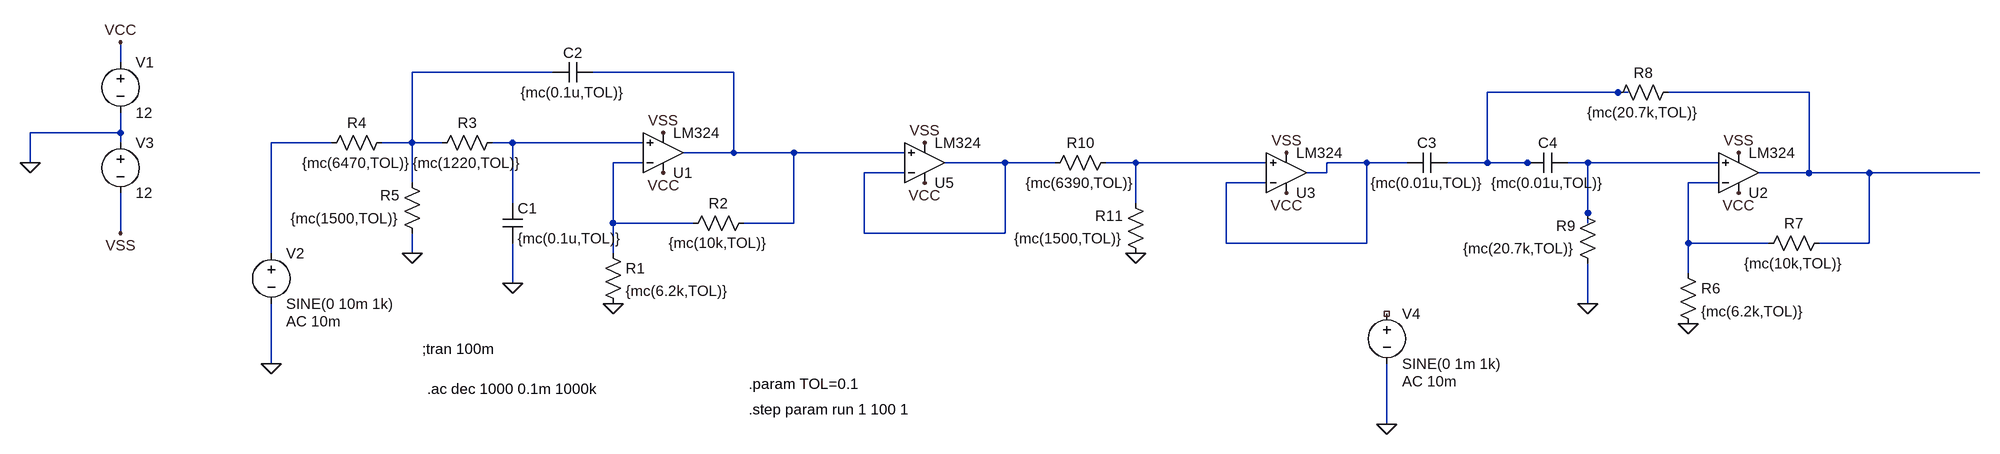
[diagram p0: schematic simulacion1_montecarloREAL.asc]
simulacion1_montecarloREAL.asc, the LTspice schematic file:
Version 4
SHEET 1 2244 700
WIRE -720 48 -720 16
WIRE -32 64 -256 64
WIRE 256 64 32 64
WIRE 1664 96 1456 96
WIRE 1680 96 1664 96
WIRE 1968 96 1744 96
WIRE -720 160 -720 128
WIRE -720 160 -864 160
WIRE -720 176 -720 160
WIRE -384 176 -480 176
WIRE -256 176 -256 64
WIRE -256 176 -304 176
WIRE -208 176 -256 176
WIRE -96 176 -128 176
WIRE 112 176 -96 176
WIRE 256 192 256 64
WIRE 256 192 176 192
WIRE 352 192 256 192
WIRE 528 192 352 192
WIRE -864 208 -864 160
WIRE 112 208 64 208
WIRE 688 208 592 208
WIRE 768 208 688 208
WIRE 896 208 848 208
WIRE 1104 208 896 208
WIRE 1264 208 1200 208
WIRE 1328 208 1264 208
WIRE 1456 208 1456 96
WIRE 1456 208 1392 208
WIRE 1520 208 1456 208
WIRE 1536 208 1520 208
WIRE 1616 208 1584 208
WIRE 1824 208 1616 208
WIRE 528 224 464 224
WIRE 1200 224 1200 208
WIRE 1200 224 1168 224
WIRE 1968 224 1968 96
WIRE 1968 224 1888 224
WIRE 2064 224 1968 224
WIRE 2240 224 2064 224
WIRE -256 240 -256 176
WIRE 1104 240 1040 240
WIRE 1824 240 1776 240
WIRE -96 272 -96 176
WIRE 896 272 896 208
WIRE 1616 288 1616 208
WIRE 64 304 64 208
WIRE 192 304 64 304
WIRE 352 304 352 192
WIRE 352 304 272 304
WIRE 1616 304 1616 288
WIRE -720 320 -720 256
WIRE 464 320 464 224
WIRE 688 320 688 208
WIRE 688 320 464 320
WIRE 1040 336 1040 240
WIRE 1264 336 1264 208
WIRE 1264 336 1040 336
WIRE 1776 336 1776 240
WIRE 1904 336 1776 336
WIRE 2064 336 2064 224
WIRE 2064 336 1984 336
WIRE -480 352 -480 176
WIRE -256 352 -256 320
WIRE 64 352 64 304
WIRE 1776 384 1776 336
WIRE -96 400 -96 336
WIRE 1616 432 1616 368
WIRE -480 528 -480 432
WIRE 1296 624 1296 528
FLAG 64 432 0
FLAG -480 528 0
FLAG -864 208 0
FLAG -720 16 VCC
FLAG 144 224 VCC
FLAG -720 320 VSS
FLAG 144 160 VSS
FLAG -96 400 0
FLAG -256 352 0
FLAG 1776 464 0
FLAG 1296 624 0
FLAG 1856 256 VCC
FLAG 1856 192 VSS
FLAG 1616 432 0
FLAG 1136 192 VSS
FLAG 1136 256 VCC
FLAG 896 352 0
FLAG 560 176 VSS
FLAG 560 240 VCC
SYMBOL AutoGenerated\\LM324 144 192 M180
SYMATTR InstName U1
SYMBOL voltage -720 32 R0
WINDOW 123 0 0 Left 0
WINDOW 39 0 0 Left 0
SYMATTR InstName V1
SYMATTR Value 12
SYMBOL res 48 336 R0
SYMATTR InstName R1
SYMATTR Value {mc(6.2k,TOL)}
SYMATTR SpiceLine tol=10
SYMBOL res 288 288 R90
WINDOW 0 0 56 VBottom 2
WINDOW 3 32 56 VTop 2
SYMATTR InstName R2
SYMATTR Value {mc(10k,TOL)}
SYMATTR SpiceLine tol=10
SYMBOL voltage -480 336 R0
WINDOW 123 24 124 Left 2
WINDOW 39 0 0 Left 0
SYMATTR Value2 AC 10m
SYMATTR InstName V2
SYMATTR Value SINE(0 10m 1k)
SYMBOL voltage -720 160 R0
WINDOW 123 0 0 Left 0
WINDOW 39 0 0 Left 0
SYMATTR InstName V3
SYMATTR Value 12
SYMBOL cap -112 272 R0
SYMATTR InstName C1
SYMATTR Value {mc(0.1u,TOL)}
SYMBOL res -112 160 R90
WINDOW 0 0 56 VBottom 2
WINDOW 3 32 56 VTop 2
SYMATTR InstName R3
SYMATTR Value {mc(1220,TOL)}
SYMATTR SpiceLine tol=10
SYMBOL res -288 160 R90
WINDOW 0 0 56 VBottom 2
WINDOW 3 32 56 VTop 2
SYMATTR InstName R4
SYMATTR Value {mc(6470,TOL)}
SYMATTR SpiceLine tol=10
SYMBOL cap 32 48 R90
WINDOW 0 0 32 VBottom 2
WINDOW 3 32 32 VTop 2
SYMATTR InstName C2
SYMATTR Value {mc(0.1u,TOL)}
SYMBOL res -240 336 R180
WINDOW 0 36 76 Left 2
WINDOW 3 36 40 Left 2
SYMATTR InstName R5
SYMATTR Value {mc(1500,TOL)}
SYMATTR SpiceLine tol=10
SYMBOL AutoGenerated\\LM324 1856 224 M180
SYMATTR InstName U2
SYMBOL res 1760 368 R0
SYMATTR InstName R6
SYMATTR Value {mc(6.2k,TOL)}
SYMATTR SpiceLine tol=10
SYMBOL res 2000 320 R90
WINDOW 0 0 56 VBottom 2
WINDOW 3 32 56 VTop 2
SYMATTR InstName R7
SYMATTR Value {mc(10k,TOL)}
SYMATTR SpiceLine tol=10
SYMBOL voltage 1296 432 R0
WINDOW 123 24 124 Left 2
WINDOW 39 0 0 Left 0
SYMATTR Value2 AC 10m
SYMATTR InstName V4
SYMATTR Value SINE(0 1m 1k)
SYMBOL res 1760 80 R90
WINDOW 0 0 56 VBottom 2
WINDOW 3 32 56 VTop 2
SYMATTR InstName R8
SYMATTR Value {mc(20.7k,TOL)}
SYMATTR SpiceLine tol=10
SYMBOL res 1632 384 R180
WINDOW 0 36 76 Left 2
WINDOW 3 36 40 Left 2
SYMATTR InstName R9
SYMATTR Value {mc(20.7k,TOL)}
SYMATTR SpiceLine tol=10
SYMBOL cap 1392 192 R90
WINDOW 0 0 32 VBottom 2
WINDOW 3 32 32 VTop 2
SYMATTR InstName C3
SYMATTR Value {mc(0.01u,TOL)}
SYMBOL cap 1584 192 R90
WINDOW 0 0 32 VBottom 2
WINDOW 3 32 32 VTop 2
SYMATTR InstName C4
SYMATTR Value {mc(0.01u,TOL)}
SYMBOL res 864 192 R90
WINDOW 0 0 56 VBottom 2
WINDOW 3 32 56 VTop 2
SYMATTR InstName R10
SYMATTR Value {mc(6390,TOL)}
SYMATTR SpiceLine tol=10
SYMBOL res 912 368 R180
WINDOW 0 36 76 Left 2
WINDOW 3 36 40 Left 2
SYMATTR InstName R11
SYMATTR Value {mc(1500,TOL)}
SYMATTR SpiceLine tol=10
SYMBOL AutoGenerated\\LM324 1136 224 M180
SYMATTR InstName U3
SYMBOL AutoGenerated\\LM324 560 208 M180
SYMATTR InstName U5
TEXT -240 504 Left 2 !;tran 100m
TEXT -232 568 Left 2 !.ac dec 1000 0.1m 1000k
TEXT 280 560 Left 2 !.param TOL=0.1
TEXT 280 600 Left 2 !.step param run 1 100 1

The netlist it stands for:
* simulacion1_montecarloREAL.asc
* U1: LM324 (symbol AutoGenerated\LM324 not available, pins judged from their places): In+=N006 In-=N007 V+=VCC V-=VSS OUT=N002
V1 VCC 0 12
R1 N007 0 {mc(6.2k,TOL)} tol=10
R2 N002 N007 {mc(10k,TOL)} tol=10
V2 N005 0 SINE(0 10m 1k) AC 10m
V3 0 VSS 12
C1 N006 0 {mc(0.1u,TOL)}
R3 N006 N001 {mc(1220,TOL)} tol=10
R4 N001 N005 {mc(6470,TOL)} tol=10
C2 N002 N001 {mc(0.1u,TOL)}
R5 0 N001 {mc(1500,TOL)} tol=10
* U2: LM324 (symbol AutoGenerated\LM324 not available, pins judged from their places): In+=N011 In-=N012 V+=VCC V-=VSS OUT=N004
R6 N012 0 {mc(6.2k,TOL)} tol=10
R7 N004 N012 {mc(10k,TOL)} tol=10
V4 NC_01 0 SINE(0 1m 1k) AC 10m
R8 N004 N003 {mc(20.7k,TOL)} tol=10
R9 0 N011 {mc(20.7k,TOL)} tol=10
C3 N003 N010 {mc(0.01u,TOL)}
C4 N011 N003 {mc(0.01u,TOL)}
R10 N009 N008 {mc(6390,TOL)} tol=10
R11 0 N009 {mc(1500,TOL)} tol=10
* U3: LM324 (symbol AutoGenerated\LM324 not available, pins judged from their places): In+=N009 In-=N010 V+=VCC V-=VSS OUT=N010
* U5: LM324 (symbol AutoGenerated\LM324 not available, pins judged from their places): In+=N002 In-=N008 V+=VCC V-=VSS OUT=N008
;tran 100m
.ac dec 1000 0.1m 1000k
.param TOL=0.1
.step param run 1 100 1
.backanno
.end